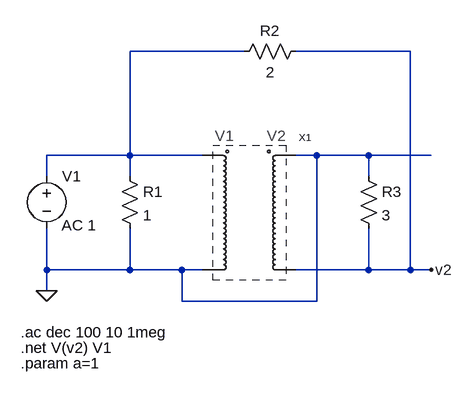
[diagram p0: schematic prueba.asc]
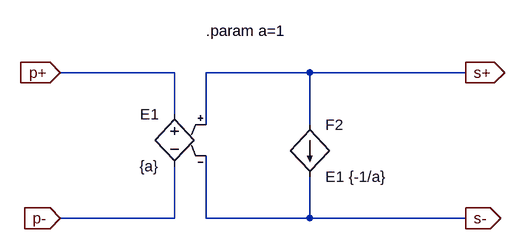
[diagram p1: sub-circuit trafoideal.asc]
prueba.asc, the LTspice schematic file:
Version 4
SHEET 1 1080 680
WIRE 144 -96 -32 -96
WIRE 400 -96 224 -96
WIRE -32 64 -32 -96
WIRE -32 64 -160 64
WIRE 80 64 -32 64
WIRE 256 64 224 64
WIRE 336 64 256 64
WIRE 432 64 336 64
WIRE -160 96 -160 64
WIRE -32 96 -32 64
WIRE 336 96 336 64
WIRE -160 240 -160 176
WIRE -32 240 -32 176
WIRE -32 240 -160 240
WIRE 48 240 -32 240
WIRE 80 240 48 240
WIRE 336 240 336 176
WIRE 336 240 224 240
WIRE 400 240 400 -96
WIRE 400 240 336 240
WIRE 432 240 400 240
WIRE -160 272 -160 240
WIRE 48 288 48 240
WIRE 256 288 256 64
WIRE 256 288 48 288
FLAG -160 272 0
FLAG 432 240 v2
SYMBOL voltage -160 80 R0
WINDOW 123 23 91 Left 2
WINDOW 39 23 119 Left 2
SYMATTR InstName V1
SYMATTR Value ""
SYMATTR Value2 AC 1
SYMBOL trafoIdeal 80 240 R0
SYMATTR InstName X1
SYMATTR SpiceLine a={a}
SYMBOL res -48 80 R0
SYMATTR InstName R1
SYMATTR Value 1
SYMBOL res 320 80 R0
SYMATTR InstName R3
SYMATTR Value 3
SYMBOL res 240 -112 R90
WINDOW 0 0 56 VBottom 2
WINDOW 3 32 56 VTop 2
SYMATTR InstName R2
SYMATTR Value 2
TEXT -200 336 Left 2 !.ac dec 100 10 1meg
TEXT -200 360 Left 2 !.net V(v2) V1
TEXT -200 384 Left 2 !.param a=1

trafoideal.asc, the sub-circuit schematic file:
Version 4
SHEET 1 880 680
WIRE 48 48 -128 48
WIRE 256 48 96 48
WIRE 496 48 256 48
WIRE 48 112 48 48
WIRE 96 128 96 48
WIRE 256 128 256 48
WIRE 48 272 48 192
WIRE 48 272 -128 272
WIRE 96 272 96 176
WIRE 256 272 256 208
WIRE 256 272 96 272
WIRE 496 272 256 272
FLAG -128 48 p+
IOPIN -128 48 In
FLAG -128 272 p-
IOPIN -128 272 In
FLAG 496 48 s+
IOPIN 496 48 Out
FLAG 496 272 s-
IOPIN 496 272 Out
SYMBOL e 48 96 M0
SYMATTR InstName E1
SYMATTR Value {a}
SYMBOL f 256 128 R0
SYMATTR InstName F2
SYMATTR Value E1 {-1/a}
TEXT 96 -16 Left 2 !.param a=1

The netlist it stands for:
* prueba.asc
V1 N001 0 AC 1
XX1 N001 0 0 v2 trafoideal params: a={a}
R1 N001 0 1
R3 0 v2 3
R2 v2 N001 2

* block symbol definitions
.subckt trafoideal p+ p- s+ s-
E1 p+ p- s+ s- {a}
F2 s+ s- E1 {-1/a}
.param a=1
.ends trafoideal

.ac dec 100 10 1meg
.net V(v2) V1
.param a=1
.backanno
.end